# EAGLE design KeypadTest (EAGLE 9.5.2)
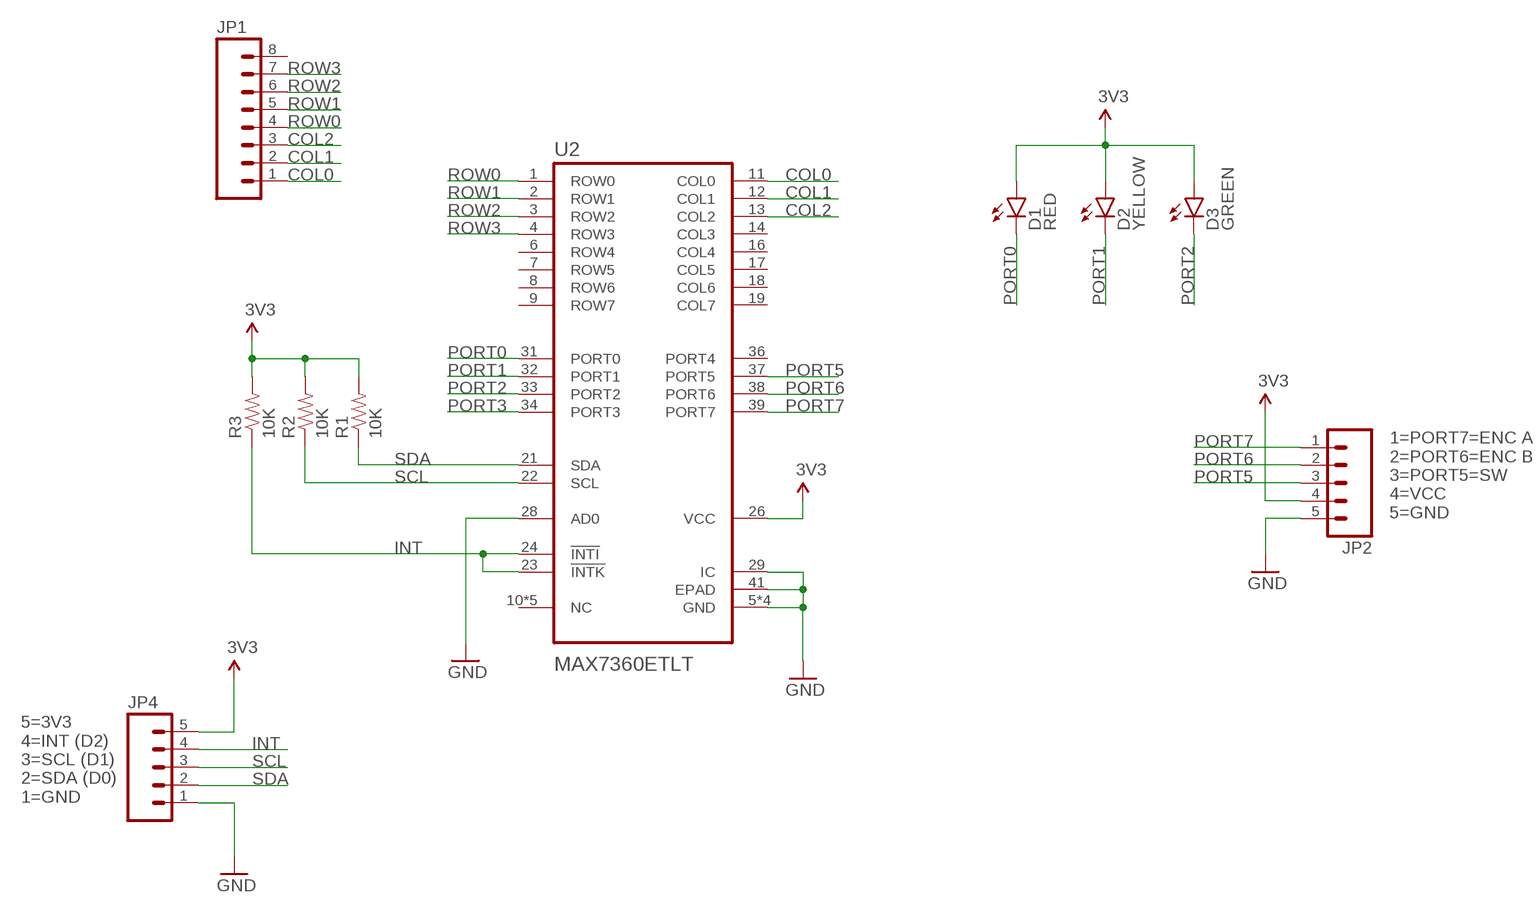
[diagram p0: schematic, sheet 1]

## Parts
D1  RED  LED-RED  [LED-0603]
D2  YELLOW  LED-YELLOW0603  [LED-0603]
D3  GREEN  LED-GREEN0603  [LED-0603]
JP1  M08SILK_FEMALE_PTH  [1X08]
JP2  M05PTH  [1X05]
JP4  M05PTH  [1X05]
R1  10K  RES-10K-06030603  [0603-RES]
R2  10K  RES-10K-06030603  [0603-RES]
R3  10K  RES-10K-06030603  [0603-RES]
U2  MAX7360ETLT  [QFN40P500X500X80-41N]

## Nets
3V3: D1.A D2.A D3.A JP2.4 JP4.5 R1.2 R2.2 R3.2 U2.26(VCC)
COL0: JP1.1 U2.11(COL0)
COL1: JP1.2 U2.12(COL1)
COL2: JP1.3 U2.13(COL2)
GND: JP2.5 JP4.1 U2.5(GND) U2.15(GND) U2.25(GND) U2.28(AD0) U2.29(IC) U2.35(GND) U2.41(EPAD)
INT: JP4.4 R3.1 U2.23(!INTK) U2.24(!INTI)
PORT0: D1.C U2.31(PORT0)
PORT1: D2.C U2.32(PORT1)
PORT2: D3.C U2.33(PORT2)
PORT3: U2.34(PORT3)
PORT5: JP2.3 U2.37(PORT5)
PORT6: JP2.2 U2.38(PORT6)
PORT7: JP2.1 U2.39(PORT7)
ROW0: JP1.4 U2.1(ROW0)
ROW1: JP1.5 U2.2(ROW1)
ROW2: JP1.6 U2.3(ROW2)
ROW3: JP1.7 U2.4(ROW3)
SCL: JP4.3 R2.1 U2.22(SCL)
SDA: JP4.2 R1.1 U2.21(SDA)
Unconnected: JP1.8 U2.6(ROW4) U2.7(ROW5) U2.8(ROW6) U2.9(ROW7) U2.10(NC) U2.14(COL3) U2.16(COL4) U2.17(COL5) U2.18(COL6) U2.19(COL7) U2.20(NC) U2.27(NC) U2.30(NC) U2.36(PORT4) U2.40(NC)

## Notes on the sheet
- 1=PORT7=ENC A
  2=PORT6=ENC B
  3=PORT5=SW
  4=VCC
  5=GND
- 5=3V3
  4=INT (D2)
  3=SCL (D1)
  2=SDA (D0)
  1=GND

## Library data of the parts
D1 = rickk2:LED-RED: LED RED CLEAR 0603 SMD $0.41 Red 631nm LED Indication - Discrete 2V 0603 (1608 Metric) 5mA@2V https://www.digikey.com/product-detail/en/lite-on-inc/LTST-C193KRKT-5A/160-1830-1-ND/2356251 Res = 270 ohm @ 3.3V Res = 680 ohm 1/8W @ 5V Res = 2.2K 1/8W @ 12V
D2 = rickk2:LED-YELLOW: Lite-On LTST-C193KSKT-5A LED YELLOW CLEAR 0603 SMD $ 0.41 Yellow 591nm LED Indication - Discrete 2V 0603 (1608 Metric) https://www.digikey.com/product-detail/en/lite-on-inc/LTST-C193KSKT-5A/160-1831-1-ND/2356253 R = 270 ohms @ 3.3V Stripe is on the anode (+) side on the bottom side!
D3 = rickk2:LED-GREEN: Lite-On LTST-C193KGKT-5A Green 572nm LED Indication - Discrete 2V 5 mA 0603 https://www.digikey.com/product-detail/en/lite-on-inc/LTST-C193KGKT-5A/160-1828-1-ND/2356247 Res = 270 ohm @ 3.3V, Res = 680 ohm 1/8W @ 5V
JP1 = rickk2:M08: Header 8 Standard 8-pin 0.1" header. Use with straight break away headers (SKU : PRT-00116), right angle break away headers (PRT-00553), swiss pins (PRT-00743), machine pins (PRT-00117), and female headers (PRT-00115).; PROD_ID: CONN-08438
JP2 JP4 = rickk2:M05: Header 5 Standard 5-pin 0.1" header. Use with straight break away headers (SKU : PRT-00116), right angle break away headers (PRT-00553), swiss pins (PRT-00743), machine pins (PRT-00117), and female headers (PRT-00115). Molex polarized connector foot print use with SKU : PRT-08230 with associated crimp pins and housings.
R1-R3 = rickk2:RES-10K-0603: RES SMD 10K OHM 5% 1/4W 0603 $ 0.10 https://www.digikey.com/product-detail/en/panasonic-electronic-components/ERJ-PA3J103V/P10KBZCT-ND/5036237
U2 = rickk2:MAX7360ETLT; DESCRIPTION: IC CTRLR KEY-SW I2C 40TQFN; DIGI-KEY_PART_NUMBER: MAX7360ETL+TCT-ND; MF: Maxim Integrated; MP: MAX7360ETL+T; PACKAGE: QFN-40 Maxim

## Board
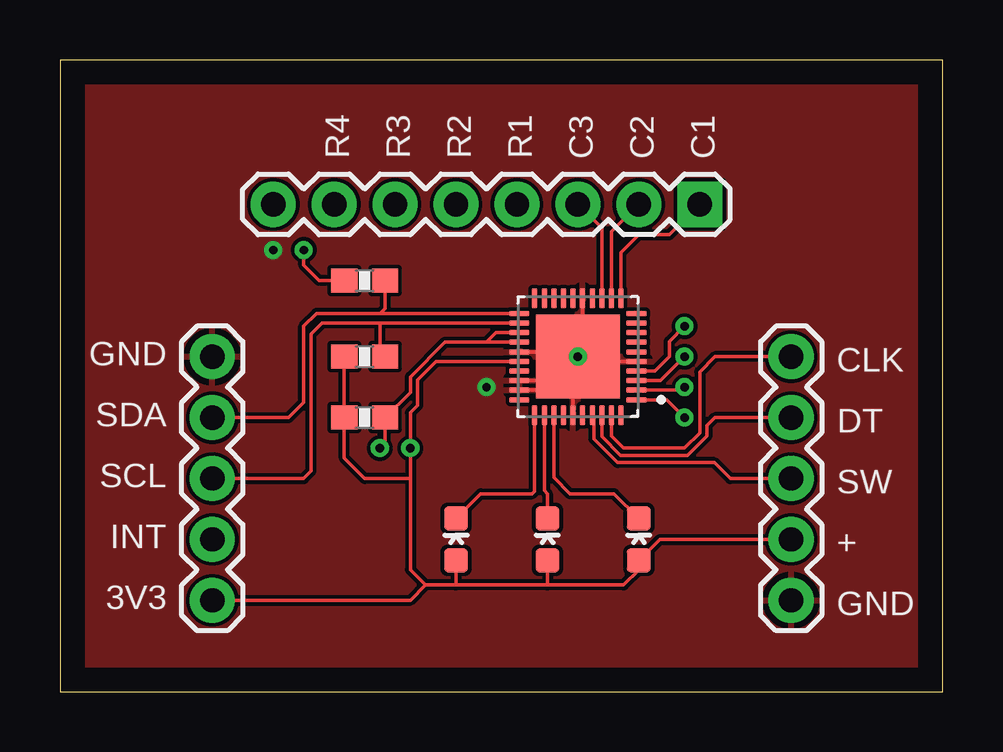
[diagram p1: board, top side]
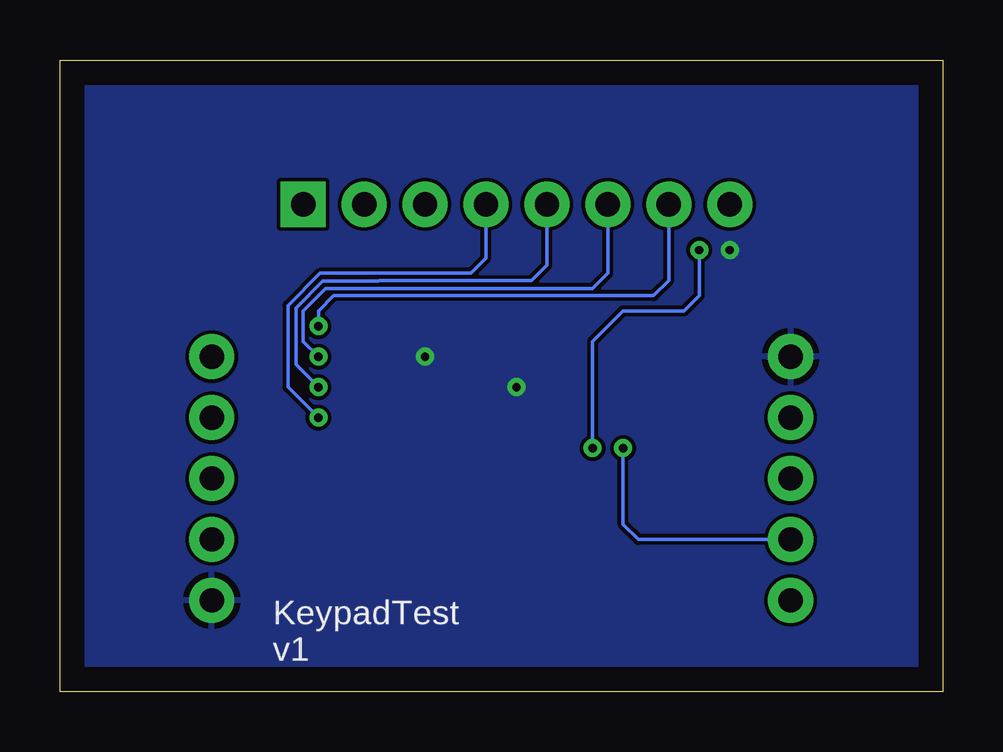
[diagram p2: board, bottom side, seen from below]

Size 36.81 x 26.34 mm. Coordinates in mm from the lower left corner, seen from the top.
Outline: 0,0 36.81,0 36.81,26.34 0,26.34 0,0
Copper layers (1*16): Top 0.035mm / dielectric 1.5mm / Bottom 0.035mm
Design rules "default": minimum track width 6mil, minimum drill 0.35mm, track to track 6mil, track to pad 6mil, pad to pad 6mil, via to via 6mil, smd to smd 6mil, copper to edge 40mil, drill to drill 6mil, minimum pad ring 10mil, minimum via ring 8mil, stop-mask expansion 4mil, vias tented up to drill 0mil, thermal gap 10mil

### Footprints (pad centres in the part's own frame; a part is rotated, then mirrored left to right if it is on the bottom)
LED-0603 = smd 1 x 1: A 0,-0.877; C 0,0.877
1X08 = drill 1.016 pad 1.88 square: 1 0,0 | drill 1.016 pad 1.88: 2 2.54,0; 3 5.08,0; 4 7.62,0; 5 10.16,0; 6 12.7,0; 7 15.24,0; 8 17.78,0
1X05 = drill 1.016 pad 1.88: 1 0,0; 2 2.54,0; 3 5.08,0; 4 7.62,0; 5 10.16,0
0603-RES = smd 1.1 x 1: 1 -0.85,0; 2 0.85,0
QFN40P500X500X80-41N = smd 0.83 x 0.22: 1 -2.44,1.8; 2 -2.44,1.4; 3 -2.44,1; 4 -2.44,0.6; 5 -2.44,0.2; 6 -2.44,-0.2; 7 -2.44,-0.6; 8 -2.44,-1; 9 -2.44,-1.4; 10 -2.44,-1.8; 21 2.44,-1.8; 22 2.44,-1.4; 23 2.44,-1; 24 2.44,-0.6; 25 2.44,-0.2; 26 2.44,0.2; 27 2.44,0.6; 28 2.44,1; 29 2.44,1.4; 30 2.44,1.8 | smd 0.22 x 0.83: 11 -1.8,-2.44; 12 -1.4,-2.44; 13 -1,-2.44; 14 -0.6,-2.44; 15 -0.2,-2.44; 16 0.2,-2.44; 17 0.6,-2.44; 18 1,-2.44; 19 1.4,-2.44; 20 1.8,-2.44; 31 1.8,2.44; 32 1.4,2.44; 33 1,2.44; 34 0.6,2.44; 35 0.2,2.44; 36 -0.2,2.44; 37 -0.6,2.44; 38 -1,2.44; 39 -1.4,2.44; 40 -1.8,2.44 | smd 3.5 x 3.5: 41 0,0

### Placement (x,y rotation side)
D1  16.51,6.35 0 top
D2  20.32,6.35 0 top
D3  24.13,6.35 0 top
JP1  26.67,20.32 180 top
JP2  30.48,13.97 270 top
JP4  6.35,13.97 270 top
R1  12.7,17.14 180 top
R2  12.7,13.97 180 top
R3  12.7,11.43 180 top
U2  21.59,13.97 180 top

### Tracks (layer width: path | path; a pad name or v marks a point on that pad's centre or on a via)
3V3  (via drill 0.35)
  Top 0.152: 14.61,8.89 v14.61,10.16 14.61,11.63 14.91,11.94 14.91,13.01 15.68,13.77 U2.26 | R1.2 10.79,17.14 10.16,17.78 v10.16,18.41 | 14.61,8.89 12.7,8.89 11.85,9.74 R3.2 R2.2 | 20.32,4.45 23.5,4.45 24.13,5.08 D3.A 25.01,6.35 JP2.4 | 20.32,4.45 16.51,4.45 | 16.51,4.45 15.24,4.45 | D2.A 20.32,4.45 | 15.24,4.45 14.61,5.08 14.61,8.89 | D1.A 16.51,4.45 | JP4.5 14.61,3.81 15.24,4.45
  Bottom 0.152: v10.16,18.41 10.16,16.51 10.79,15.88 13.34,15.88 14.61,14.61 v14.61,10.16
COL0
  Top 0.152: U2.11 23.39,18.31 24.13,19.05 25.4,19.05 JP1.1
COL1
  Top 0.152: U2.12 22.99,19.18 JP1.2
COL2
  Top 0.152: U2.13 22.59,19.32 JP1.3
GND  (via drill 0.35)
  Top 0.152: U2.28 20.59,12.97 | U2.25 21.39,14.17 U2.41 | U2.5 21.79,13.77 U2.41 | U2.15 21.79,14.17 U2.41 | U2.35 21.39,12.7 | 21.39,12.7 21.39,13.77 U2.41 | U2.29 21.26,12.57 21.39,12.7
  other vias: 8.89,18.41 17.78,12.7 21.59,13.97
  pour Top: 0,0 0,27.94 40.64,27.94 40.64,0
  pour Bottom: 0,0 0,29.21 39.37,29.21 39.37,0
INT  (via drill 0.35)
  Top 0.152: 17.78,14.57 16.04,14.57 14.61,13.13 14.61,12.48 R3.1 13.55,10.38 v13.34,10.16 | 17.78,14.57 U2.24 | U2.23 18.18,14.97 17.78,14.57
  Bottom 0.152: JP4.4 12.7,6.35 13.34,6.99 v13.34,10.16
PORT0
  Top 0.152: U2.31 19.79,8.36 19.68,8.26 17.54,8.26 D1.C
PORT1
  Top 0.152: U2.32 20.19,8.38 20.32,8.26 D2.C
PORT2
  Top 0.152: U2.33 20.59,8.93 21.26,8.26 23.1,8.26 D3.C
PORT5
  Top 0.152: JP2.3 27.94,8.89 27.28,9.55 23.24,9.55 22.25,10.54 22.25,11.47 U2.37
PORT6
  Top 0.152: JP2.2 27.3,11.43 26.98,11.1 26.98,10.67 26.16,9.86 23.37,9.86 22.59,10.63 U2.38
PORT7
  Top 0.152: JP2.1 27.3,13.97 26.67,13.34 26.67,10.79 26.04,10.16 23.5,10.16 22.99,10.66 U2.39
ROW0  (via drill 0.35)
  Top 0.152: U2.1 25.3,12.17 v26.04,11.43
  Bottom 0.152: JP1.4 19.05,18.09 19.68,17.45 25.96,17.45 27.3,16.1 27.3,12.7 v26.04,11.43
ROW1  (via drill 0.35)
  Top 0.152: U2.2 25.91,12.57 v26.04,12.7
  Bottom 0.152: JP1.5 16.51,17.78 17.14,17.14 23.5,17.14 23.52,17.12 25.86,17.12 26.98,16 26.98,13.64 v26.04,12.7
ROW2  (via drill 0.35)
  Top 0.152: U2.3 25.04,12.97 v26.04,13.97
  Bottom 0.152: JP1.6 13.97,17.45 14.61,16.82 25.73,16.82 26.67,15.88 26.67,14.61 v26.04,13.97
ROW3  (via drill 0.35)
  Top 0.152: U2.4 24.8,13.37 25.4,13.97 25.4,14.61 v26.04,15.24
  Bottom 0.152: JP1.7 11.43,17.14 12.06,16.51 25.4,16.51 26.04,15.88 v26.04,15.24
SCL
  Top 0.152: U2.22 13.34,15.37 | 13.34,15.37 10.93,15.37 10.46,14.91 10.46,9.2 10.16,8.89 JP4.3 | R2.1 13.34,14.19 13.34,15.37
SDA
  Top 0.152: U2.21 13.34,15.77 | 13.34,15.77 10.69,15.77 10.16,15.24 10.16,12.06 9.53,11.43 JP4.2 | R1.1 13.55,15.98 13.34,15.77

### Text on the board
tPlace: R4 | R3 | R2 | R1 | C3 | C2 | C1 | GND | CLK | SDA | DT | SCL | SW | INT | + | 3V3 | GND
bPlace: KeypadTest / v1